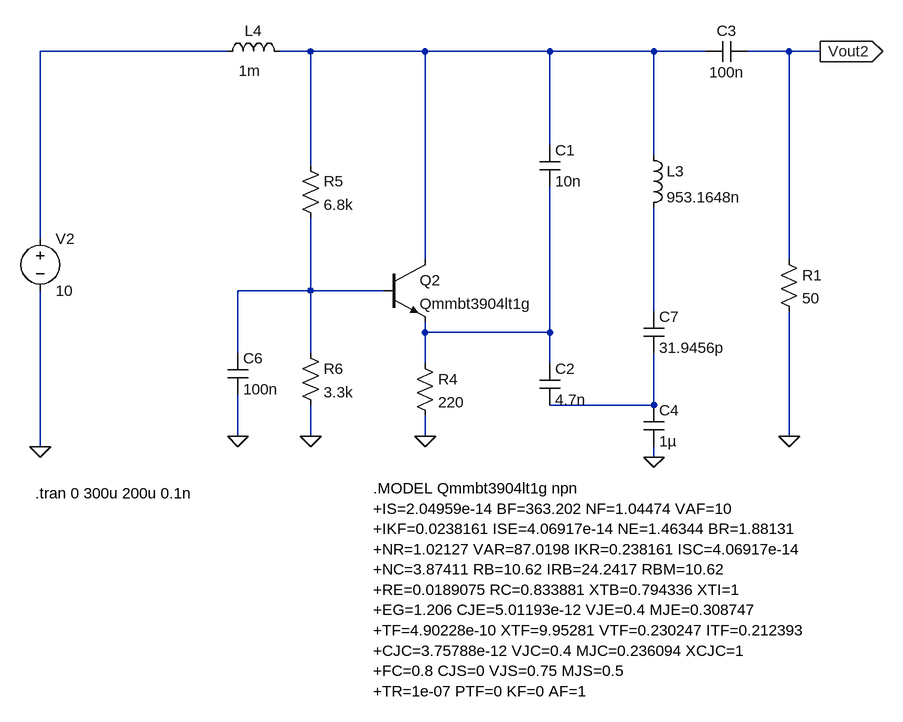
[diagram p0: schematic osc_clapp.asc]
osc_clapp.asc, the LTspice schematic file:
Version 4
SHEET 1 2992 1448
WIRE 1216 -64 928 -64
WIRE 1344 -64 1296 -64
WIRE 1520 -64 1344 -64
WIRE 1712 -64 1520 -64
WIRE 1872 -64 1712 -64
WIRE 1952 -64 1872 -64
WIRE 2080 -64 2016 -64
WIRE 2128 -64 2080 -64
WIRE 1712 80 1712 -64
WIRE 1872 96 1872 -64
WIRE 1344 112 1344 -64
WIRE 928 224 928 -64
WIRE 1520 256 1520 -64
WIRE 2080 256 2080 -64
WIRE 1344 304 1344 192
WIRE 1344 304 1232 304
WIRE 1456 304 1344 304
WIRE 1872 336 1872 176
WIRE 1520 368 1520 352
WIRE 1712 368 1712 144
WIRE 1712 368 1520 368
WIRE 1232 400 1232 304
WIRE 1344 400 1344 304
WIRE 1520 416 1520 368
WIRE 1712 416 1712 368
WIRE 1872 480 1872 400
WIRE 1872 480 1712 480
WIRE 1232 528 1232 464
WIRE 1344 528 1344 480
WIRE 1520 528 1520 496
WIRE 2080 528 2080 336
WIRE 928 544 928 304
WIRE 1872 560 1872 544
FLAG 1344 528 0
FLAG 928 544 0
FLAG 1232 528 0
FLAG 1520 528 0
FLAG 2128 -64 Vout2
IOPIN 2128 -64 Out
FLAG 1872 560 0
FLAG 2080 528 0
SYMBOL npn 1456 256 R0
SYMATTR InstName Q2
SYMATTR Value Qmmbt3904lt1g
SYMBOL res 1504 400 R0
SYMATTR InstName R4
SYMATTR Value 220
SYMBOL res 1328 96 R0
SYMATTR InstName R5
SYMATTR Value 6.8k
SYMBOL res 1328 384 R0
SYMATTR InstName R6
SYMATTR Value 3.3k
SYMBOL voltage 928 208 R0
WINDOW 123 0 0 Left 0
WINDOW 39 0 0 Left 0
SYMATTR InstName V2
SYMATTR Value 10
SYMBOL cap 1696 416 R0
SYMATTR InstName C2
SYMATTR Value 4.7n
SYMBOL cap 1696 80 R0
SYMATTR InstName C1
SYMATTR Value 10n
SYMBOL ind 1856 80 R0
SYMATTR InstName L3
SYMATTR Value 953.1648n
SYMBOL cap 1216 400 R0
SYMATTR InstName C6
SYMATTR Value 100n
SYMBOL ind 1200 -48 R270
WINDOW 0 32 56 VTop 2
WINDOW 3 2 50 VBottom 2
SYMATTR InstName L4
SYMATTR Value 1m
SYMATTR SpiceLine Rpar=200k Cpar=10p
SYMBOL cap 1856 336 R0
SYMATTR InstName C7
SYMATTR Value 31.9456p
SYMBOL res 2064 240 R0
SYMATTR InstName R1
SYMATTR Value 50
SYMBOL cap 2016 -80 R90
WINDOW 0 0 32 VBottom 2
WINDOW 3 32 32 VTop 2
SYMATTR InstName C3
SYMATTR Value 100n
SYMBOL cap 1856 480 R0
SYMATTR InstName C4
SYMATTR Value 1µ
TEXT 920 616 Left 2 !.tran 0 300u 200u 0.1n
TEXT 1440 608 Left 2 !.MODEL Qmmbt3904lt1g npn\n+IS=2.04959e-14 BF=363.202 NF=1.04474 VAF=10\n+IKF=0.0238161 ISE=4.06917e-14 NE=1.46344 BR=1.88131\n+NR=1.02127 VAR=87.0198 IKR=0.238161 ISC=4.06917e-14\n+NC=3.87411 RB=10.62 IRB=24.2417 RBM=10.62\n+RE=0.0189075 RC=0.833881 XTB=0.794336 XTI=1\n+EG=1.206 CJE=5.01193e-12 VJE=0.4 MJE=0.308747\n+TF=4.90228e-10 XTF=9.95281 VTF=0.230247 ITF=0.212393\n+CJC=3.75788e-12 VJC=0.4 MJC=0.236094 XCJC=1\n+FC=0.8 CJS=0 VJS=0.75 MJS=0.5\n+TR=1e-07 PTF=0 KF=0 AF=1

The netlist it stands for:
* osc_clapp.asc
Q2 N002 N003 N005 0 Qmmbt3904lt1g
R4 N005 0 220
R5 N002 N003 6.8k
R6 N003 0 3.3k
V2 N001 0 10
C2 N005 N006 4.7n
C1 N002 N005 10n
L3 N002 N004 953.1648n
C6 N003 0 100n
L4 N001 N002 1m Rpar=200k Cpar=10p
C7 N004 N006 31.9456p
R1 Vout2 0 50
C3 Vout2 N002 100n
C4 N006 0 1µ
.model NPN NPN
.model PNP PNP
.lib standard.bjt
.tran 0 300u 200u 0.1n
.MODEL Qmmbt3904lt1g npn
+IS=2.04959e-14 BF=363.202 NF=1.04474 VAF=10
+IKF=0.0238161 ISE=4.06917e-14 NE=1.46344 BR=1.88131
+NR=1.02127 VAR=87.0198 IKR=0.238161 ISC=4.06917e-14
+NC=3.87411 RB=10.62 IRB=24.2417 RBM=10.62
+RE=0.0189075 RC=0.833881 XTB=0.794336 XTI=1
+EG=1.206 CJE=5.01193e-12 VJE=0.4 MJE=0.308747
+TF=4.90228e-10 XTF=9.95281 VTF=0.230247 ITF=0.212393
+CJC=3.75788e-12 VJC=0.4 MJC=0.236094 XCJC=1
+FC=0.8 CJS=0 VJS=0.75 MJS=0.5
+TR=1e-07 PTF=0 KF=0 AF=1
.backanno
.end